# EAGLE design PCB-BI8-SE-C30 (EAGLE 6.4)
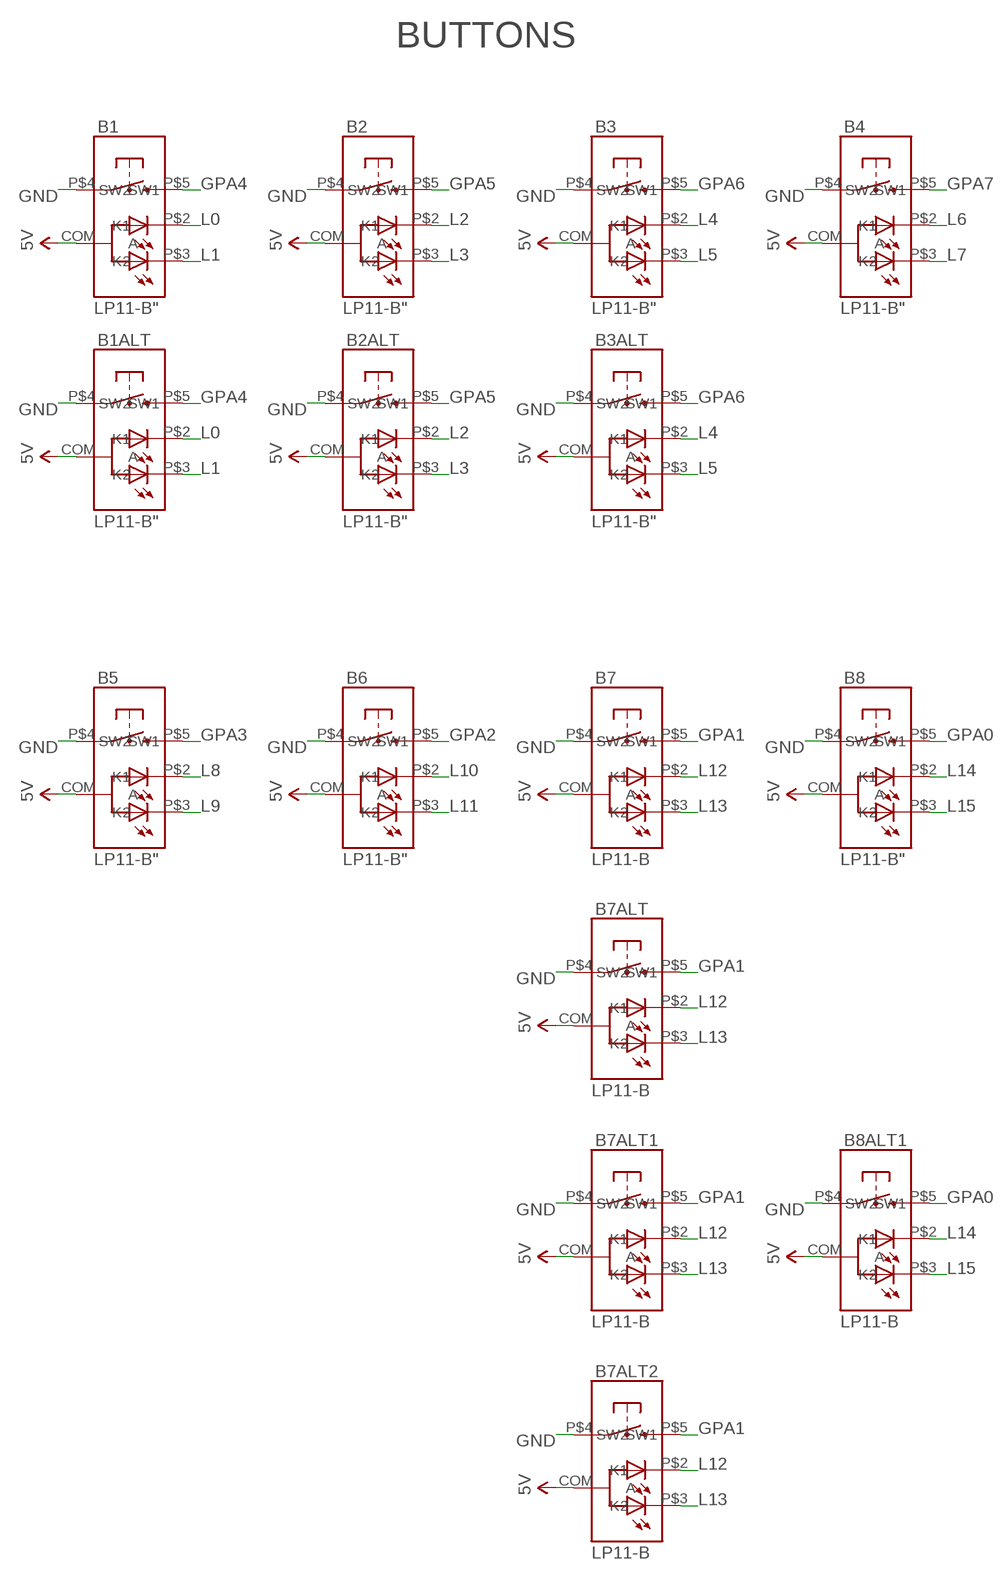
[diagram p0: schematic, sheet 1, part 1 of 2]
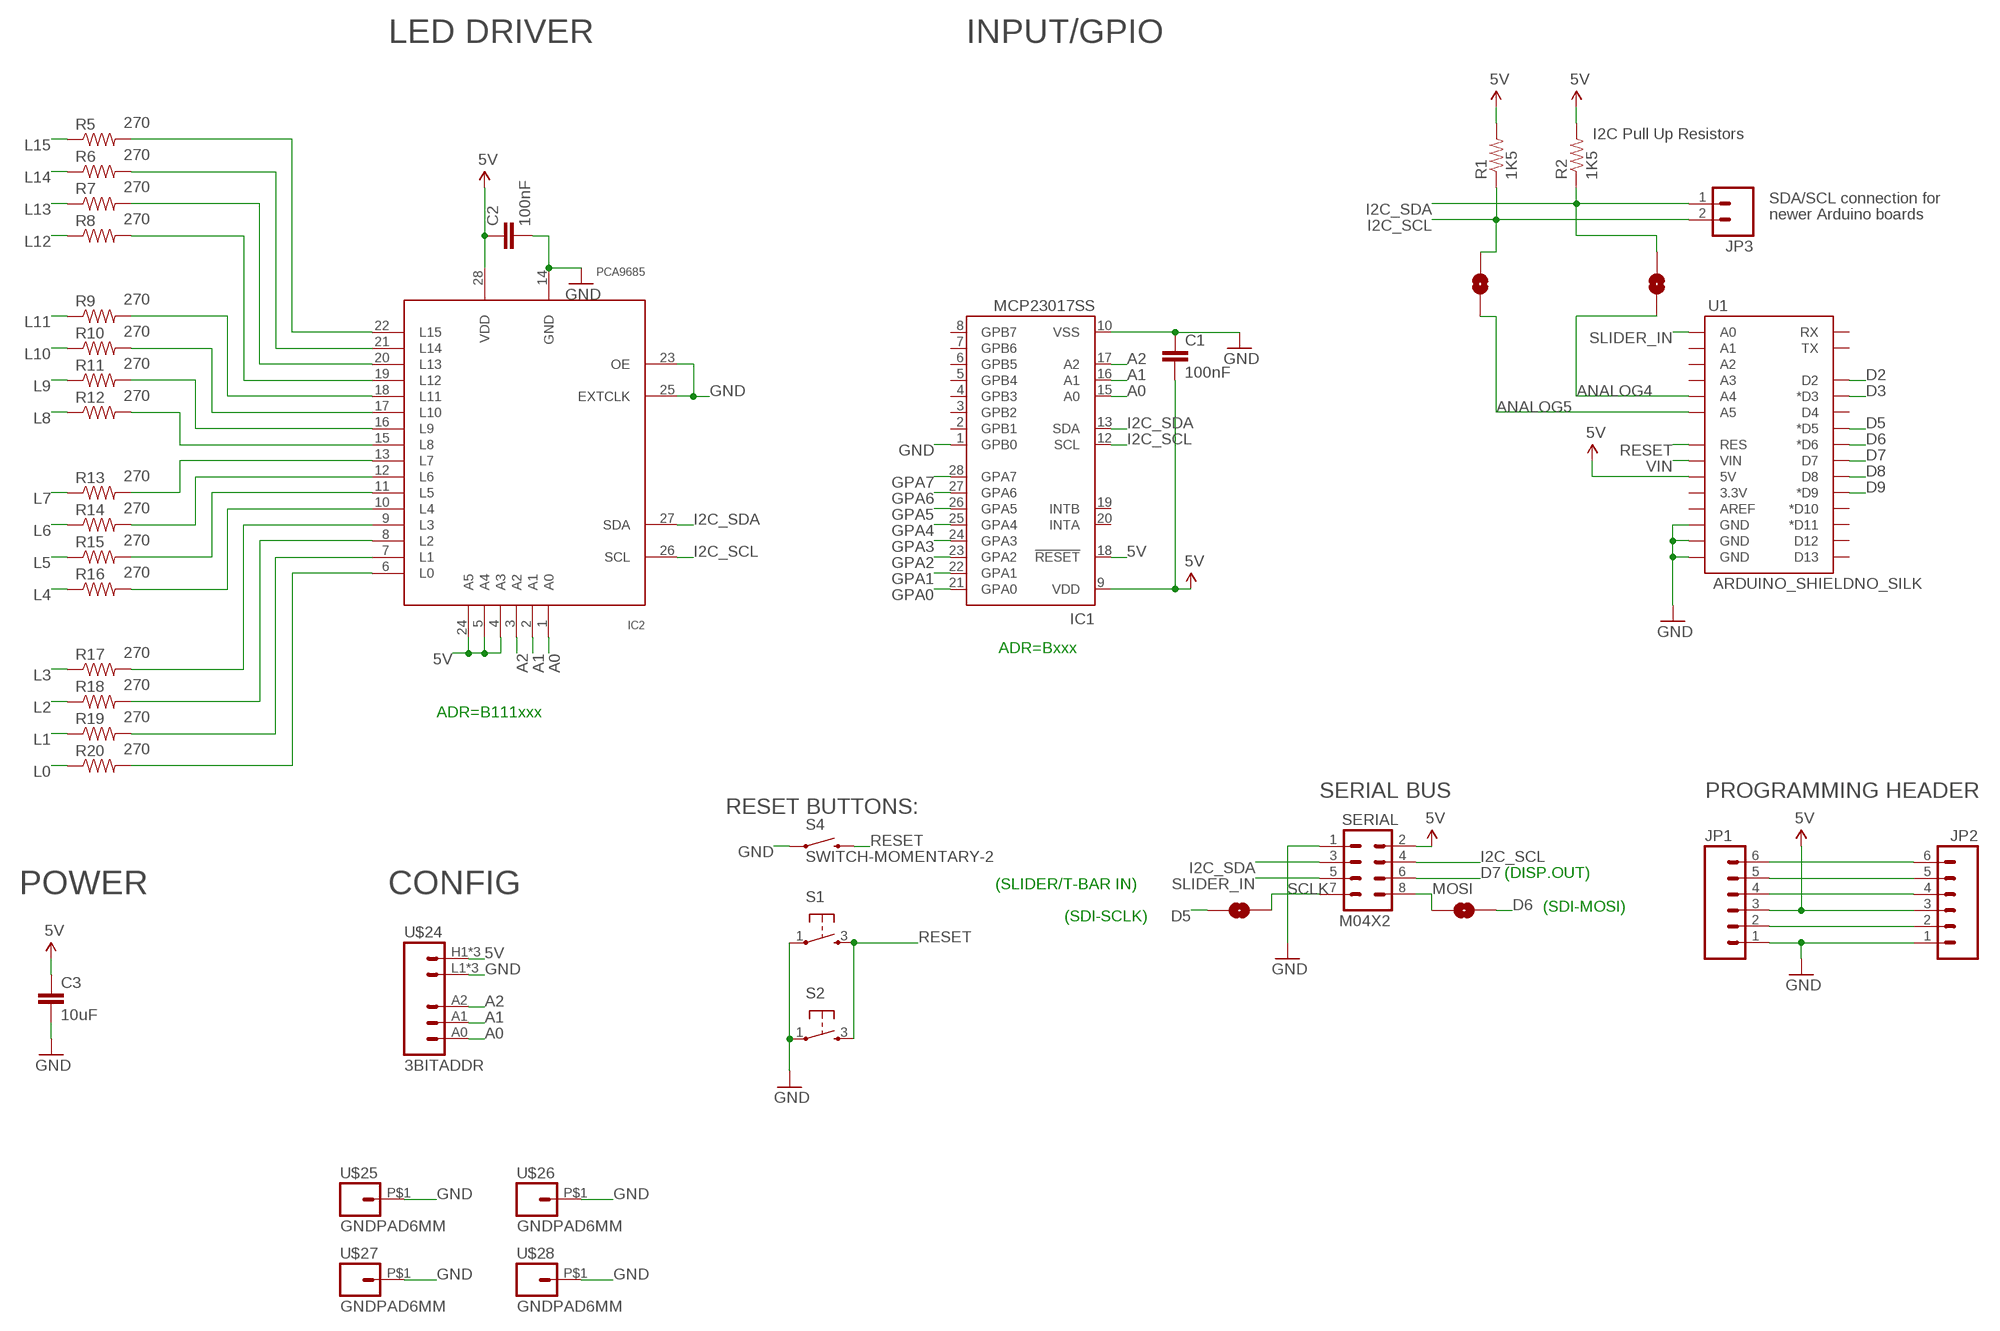
[diagram p1: schematic, sheet 1, part 2 of 2]

## Parts
B1  LP11-B"  [LP11]
B1ALT  LP11-B"  [LP11]
B2  LP11-B"  [LP11]
B2ALT  LP11-B"  [LP11]
B3  LP11-B"  [LP11]
B3ALT  LP11-B"  [LP11]
B4  LP11-B"  [LP11]
B5  LP11-B"  [LP11]
B6  LP11-B"  [LP11]
B7  LP11-B  [LP11_NOFIXHOLES]
B7ALT  LP11-B  [LP11_NOFIXHOLES]
B7ALT1  LP11-B  [LP11_NOFIXHOLES]
B7ALT2  LP11-B  [LP11_NOFIXHOLES]
B8  LP11-B"  [LP11]
B8ALT1  LP11-B  [LP11_NOFIXHOLES]
C1  100nF  CAP0603-CAP  [0603-CAP]
C2  100nF  CAP0603-CAP  [0603-CAP]
C3  10uF  CAP0805  [0805]
IC1  MCP23017SS  [SSOP28]
IC2  PCA9685  [TSSOP28]
JP1  M06POLAR  [MOLEX-1X6]
JP2  M06POLAR  [MOLEX-1X6]
JP3  M02PTH  [1X02]
MOSI->D6  SOLDERJUMPERNC  [SJ_2S]
R1  1K5  RESISTOR0603-RES  [0603-RES]
R2  1K5  RESISTOR0603-RES  [0603-RES]
R5  270  RESISTOR0603-RES  [0603-RES]
R6  270  RESISTOR0603-RES  [0603-RES]
R7  270  RESISTOR0603-RES  [0603-RES]
R8  270  RESISTOR0603-RES  [0603-RES]
R9  270  RESISTOR0603-RES  [0603-RES]
R10  270  RESISTOR0603-RES  [0603-RES]
R11  270  RESISTOR0603-RES  [0603-RES]
R12  270  RESISTOR0603-RES  [0603-RES]
R13  270  RESISTOR0603-RES  [0603-RES]
R14  270  RESISTOR0603-RES  [0603-RES]
R15  270  RESISTOR0603-RES  [0603-RES]
R16  270  RESISTOR0603-RES  [0603-RES]
R17  270  RESISTOR0603-RES  [0603-RES]
R18  270  RESISTOR0603-RES  [0603-RES]
R19  270  RESISTOR0603-RES  [0603-RES]
R20  270  RESISTOR0603-RES  [0603-RES]
S1  TAC_SWITCH  [PUSHBUTTON]
S2  TAC_SWITCH  [PUSHBUTTON]
S3->A2  SOLDERJUMPERNC  [SJ_2S]
S3->A3  SOLDERJUMPERNC  [SJ_2S]
S4  SWITCH-MOMENTARY-2  [TACTILE_SWITCH_TALL]
SCLK->D5  SOLDERJUMPERNC  [SJ_2S]
SERIAL  M04X2  [2X4]
U1  ARDUINO_SHIELDNO_SILK  [DUEMILANOVE_VIAS]
U$24  3BITADDR  [3BITADDR]
U$25  GNDPAD6MM  [3.2MMPAD6MM]
U$26  GNDPAD6MM  [3.2MMPAD6MM]
U$27  GNDPAD6MM  [3.2MMPAD6MM]
U$28  GNDPAD6MM  [3.2MMPAD6MM]

## Nets
5V [Power]: B1.COM(A) B1ALT.COM(A) B2.COM(A) B2ALT.COM(A) B3.COM(A) B3ALT.COM(A) B4.COM(A) B5.COM(A) B6.COM(A) B7.COM(A) B7ALT1.COM(A) B7ALT2.COM(A) B7ALT.COM(A) B8.COM(A) B8ALT1.COM(A) C1.2 C2.1 C3.1 IC1.9(VDD) IC1.18(!RESET) IC2.4(A3) IC2.5(A4) IC2.24(A5) IC2.28(VDD) JP1.3 JP2.3 R1.2 R2.2 SERIAL.2 U1.5V U$24.H1(VCC) U$24.H2(VCC) U$24.H3(VCC)
A0: IC1.15(A0) IC2.1(A0) U$24.A0
A1: IC1.16(A1) IC2.2(A1) U$24.A1
A2: IC1.17(A2) IC2.3(A2) U$24.A2
ANALOG4: S3->A3.2 U1.A4
ANALOG5: S3->A2.2 U1.A5
D2: U1.D2
D3: U1.D3(*D3)
D5: SCLK->D5.1 U1.D5(*D5)
D6: MOSI->D6.2 U1.D6(*D6)
D7: SERIAL.6 U1.D7
D8: U1.D8
D9: U1.D9(*D9)
GND [Power]: B1.P$4(SW1) B1ALT.P$4(SW1) B2.P$4(SW1) B2ALT.P$4(SW1) B3.P$4(SW1) B3ALT.P$4(SW1) B4.P$4(SW1) B5.P$4(SW1) B6.P$4(SW1) B7.P$4(SW1) B7ALT1.P$4(SW1) B7ALT2.P$4(SW1) B7ALT.P$4(SW1) B8.P$4(SW1) B8ALT1.P$4(SW1) C1.1 C2.2 C3.2 IC1.1(GPB0) IC1.10(VSS) IC2.14(GND) IC2.23(OE) IC2.25(EXTCLK) JP1.1 JP2.1 S1.1 S2.1 S4.A2 SERIAL.1 U1.GND@0(GND) U1.GND@1(GND) U1.GND@2(GND) U$24.L1(GND) U$24.L2(GND) U$24.L3(GND) U$25.P$1 U$26.P$1 U$27.P$1 U$28.P$1
GPA0: B8.P$5(SW2) B8ALT1.P$5(SW2) IC1.21(GPA0)
GPA1: B7.P$5(SW2) B7ALT1.P$5(SW2) B7ALT2.P$5(SW2) B7ALT.P$5(SW2) IC1.22(GPA1)
GPA2: B6.P$5(SW2) IC1.23(GPA2)
GPA3: B5.P$5(SW2) IC1.24(GPA3)
GPA4: B1.P$5(SW2) B1ALT.P$5(SW2) IC1.25(GPA4)
GPA5: B2.P$5(SW2) B2ALT.P$5(SW2) IC1.26(GPA5)
GPA6: B3.P$5(SW2) B3ALT.P$5(SW2) IC1.27(GPA6)
GPA7: B4.P$5(SW2) IC1.28(GPA7)
I2C_SCL: IC1.12(SCL) IC2.26(SCL) JP3.2 R1.1 S3->A2.1 SERIAL.4
I2C_SDA: IC1.13(SDA) IC2.27(SDA) JP3.1 R2.1 S3->A3.1 SERIAL.3
L0: B1.P$2(K1) B1ALT.P$2(K1) R20.1
L1: B1.P$3(K2) B1ALT.P$3(K2) R19.1
L2: B2.P$2(K1) B2ALT.P$2(K1) R18.1
L3: B2.P$3(K2) B2ALT.P$3(K2) R17.1
L4: B3.P$2(K1) B3ALT.P$2(K1) R16.1
L5: B3.P$3(K2) B3ALT.P$3(K2) R15.1
L6: B4.P$2(K1) R14.1
L7: B4.P$3(K2) R13.1
L8: B5.P$2(K1) R12.1
L9: B5.P$3(K2) R11.1
L10: B6.P$2(K1) R10.1
L11: B6.P$3(K2) R9.1
L12: B7.P$2(K1) B7ALT1.P$2(K1) B7ALT2.P$2(K1) B7ALT.P$2(K1) R8.1
L13: B7.P$3(K2) B7ALT1.P$3(K2) B7ALT2.P$3(K2) B7ALT.P$3(K2) R7.1
L14: B8.P$2(K1) B8ALT1.P$2(K1) R6.1
L15: B8.P$3(K2) B8ALT1.P$3(K2) R5.1
MOSI: MOSI->D6.1 SERIAL.8
N$1: JP1.2 JP2.2
N$4: IC2.13(L7) R13.2
N$5: IC2.12(L6) R14.2
N$7: IC2.11(L5) R15.2
N$9: IC2.10(L4) R16.2
N$10: IC2.9(L3) R17.2
N$11: IC2.8(L2) R18.2
N$12: IC2.7(L1) R19.2
N$19: IC2.6(L0) R20.2
N$20: IC2.15(L8) R12.2
N$21: IC2.16(L9) R11.2
N$22: IC2.17(L10) R10.2
N$23: IC2.18(L11) R9.2
N$24: IC2.19(L12) R8.2
N$25: IC2.20(L13) R7.2
N$26: IC2.21(L14) R6.2
N$27: IC2.22(L15) R5.2
N$33: JP1.4 JP2.4
N$34: JP1.5 JP2.5
N$45: JP1.6 JP2.6
RESET: S1.3 S2.3 S4.B2 U1.RES
SCLK: SCLK->D5.2 SERIAL.7
SLIDER_IN: SERIAL.5 U1.A0
VIN [Power]: U1.VIN
Unconnected: IC1.2(GPB1) IC1.3(GPB2) IC1.4(GPB3) IC1.5(GPB4) IC1.6(GPB5) IC1.7(GPB6) IC1.8(GPB7) IC1.19(INTB) IC1.20(INTA) U1.3.3V U1.A1 U1.A2 U1.A3 U1.AREF U1.D4 U1.D10(*D10) U1.D11(*D11) U1.D12 U1.D13 U1.RX U1.TX

## Notes on the sheet
- BUTTONS | LED DRIVER | INPUT/GPIO
- I2C Pull Up Resistors
- SDA/SCL connection for
- newer Arduino boards
- ADR=Bxxx
- ADR=B111xxx
- SERIAL BUS | PROGRAMMING HEADER
- RESET BUTTONS:
- (DISP.OUT)
- (SLIDER/T-BAR IN)
- POWER | CONFIG
- (SDI-MOSI)
- (SDI-SCLK)

## Library data of the parts
B1 B1ALT B2 B2ALT B3 B3ALT B4-B7 B7ALT B7ALT1 B7ALT2 B8 B8ALT1 = SKAARHOJ:LP11-B
C1-C3 = SparkFun:CAP: Capacitor Standard 0603 ceramic capacitor, and 0.1" leaded capacitor.
IC1 = microchip:MCP23017: http://ww1.microchip.com/downloads/en/DeviceDoc/21952a.pdf Source: http://ww1.microchip.com/downloads/en/DeviceDoc/21952a.pdf; MF: MICROCHIP; MPN: MCP23017-E/SS; OC_FARNELL: 1467674; OC_NEWARK: 31K2960
IC2 = wsmith:PCA9685
JP1 JP2 = SparkFun:M06: Header 6 Standard 6-pin 0.1" header. Use with straight break away headers (SKU : PRT-00116), right angle break away headers (PRT-00553), swiss pins (PRT-00743), machine pins (PRT-00117), and female headers (PRT-00115). Molex polarized connector foot print use with SKU : PRT-08094 with associated crimp pins and housings. NOTES ON THE VARIANTS LOCK and LOCK_LONGPADS... This footprint was designed to help hold the alignment of a through-hole component (i.e. 6-pin header) while soldering it into place. You may notice that each hole has been shifted either up or down by 0.005 of an inch from it's more standard position (which is a perfectly straight line). This slight alteration caused the pins (the squares in the middle) to touch the edges of the holes. Because they are alternating, it causes a "brace" to hold the component in place. 0.005 has proven to be the perfect amount of "off-center" position when using our standard breakaway headers. Although looks a little odd when you look at the bare footprint, once you have a header in there, the alteration is very hard to notice. Also, if you push a header all the way into place, it is covered up entirely on the bottom side. This idea of altering the position of holes to aid alignment will be further integrated into the Sparkfun Library for other footprints. It can help hold any component with 3 or more connection pins.
JP3 = SparkFun:M02: Header 2 Standard 2-pin 0.1" header. Use with straight break away headers (SKU : PRT-00116), right angle break away headers (PRT-00553), swiss pins (PRT-00743), machine pins (PRT-00117), and female headers (PRT-00115). Molex polarized connector foot print use with SKU : PRT-08233 with associated crimp pins and housings.
MOSI->D6 S3->A2 S3->A3 SCLK->D5 = SparkFun:SOLDERJUMPER: Solder Jumper Standard SMD solder jumper. Used to automate production. Two varients : Normally Open and Normally Closed are the same, but have different paste layers. NC will have a large amount of paste and should jumper during reflow.
R1 R2 R5-R20 = SparkFun:RESISTOR: Resistor Basic schematic elements and footprints for 0603, 1206, and PTH resistors.
S1 S2 = SKAARHOJ:TAC_SWITCH: Momentary Switch Button commonly used for reset or general input. Spark Fun Electronics SKU : COM-00097
S4 = SparkFun:SWITCH-MOMENTARY-2
SERIAL = SparkFun:M04X2
U1 = SparkFun:ARDUINO_SHIELD
U$24 = SKAARHOJ:3BITADDR
U$25-U$28 = SKAARHOJ:GNDPAD

## Net classes
0 default: width 0.203 mm, drill 0.406 mm, clearance 0.203 mm
1 Power: width 0.406 mm, drill 0.61 mm, clearance 0.203 mm

## Board
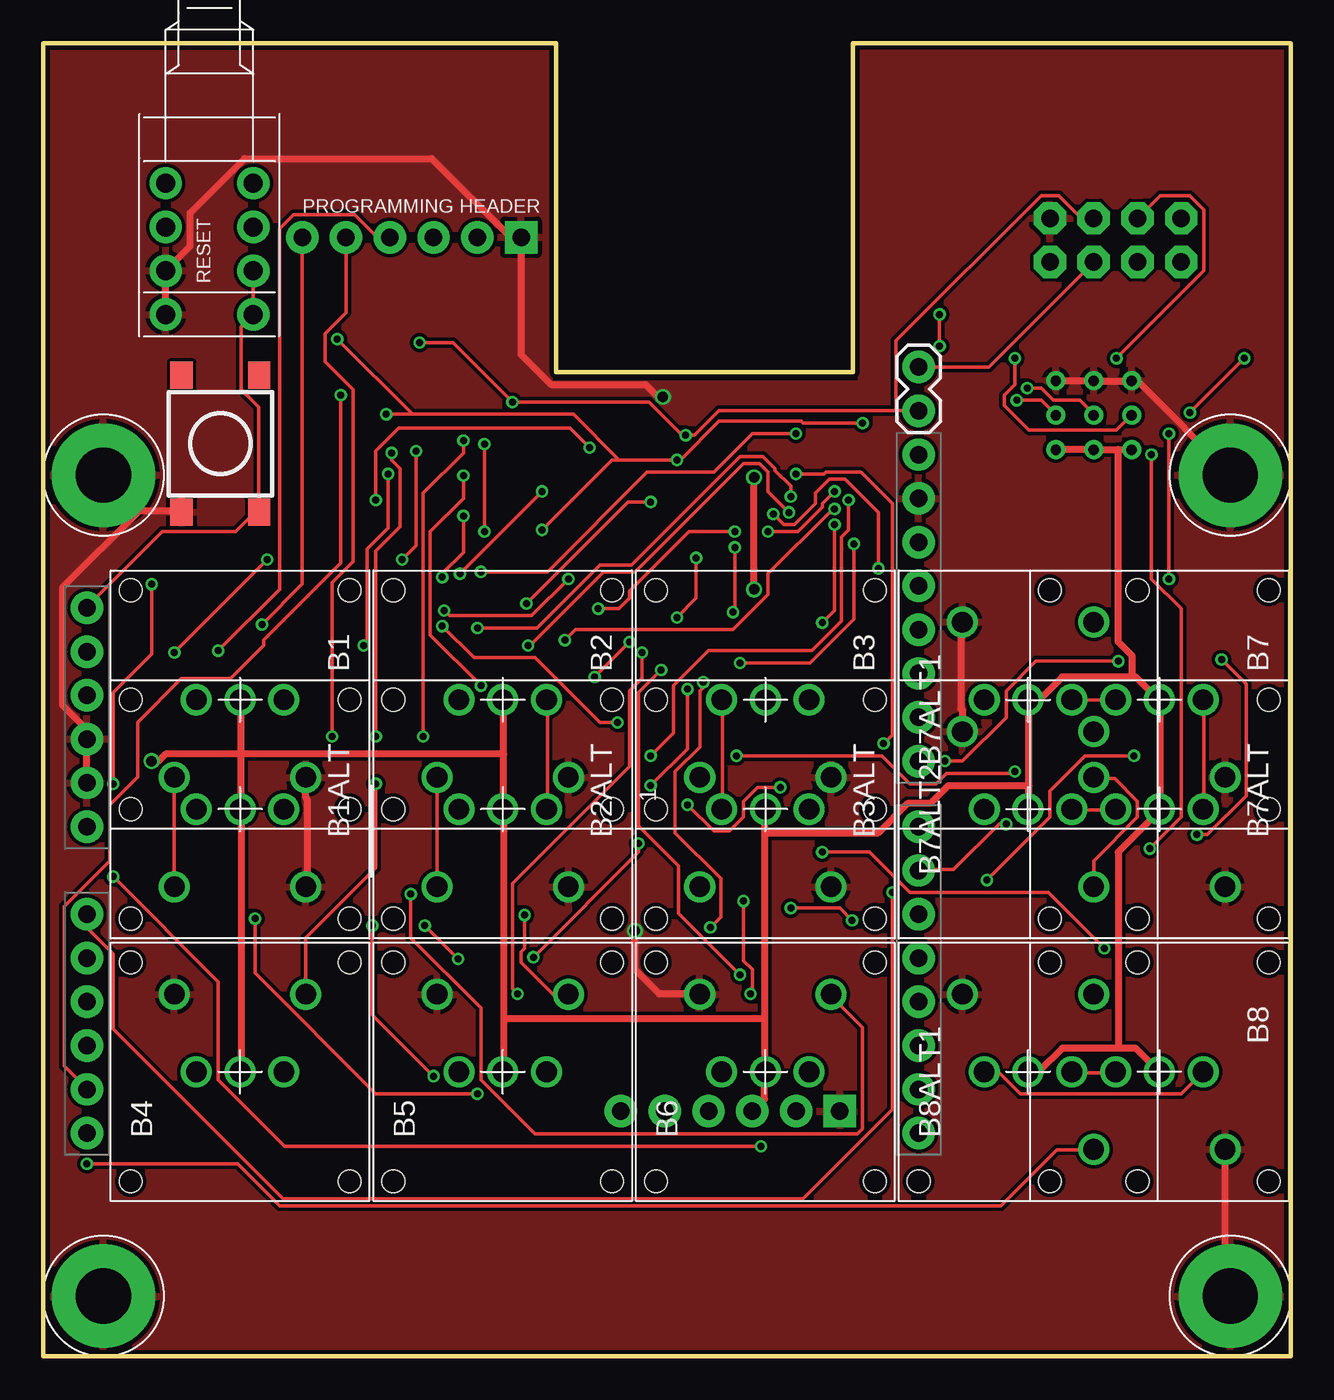
[diagram p2: board, top side]
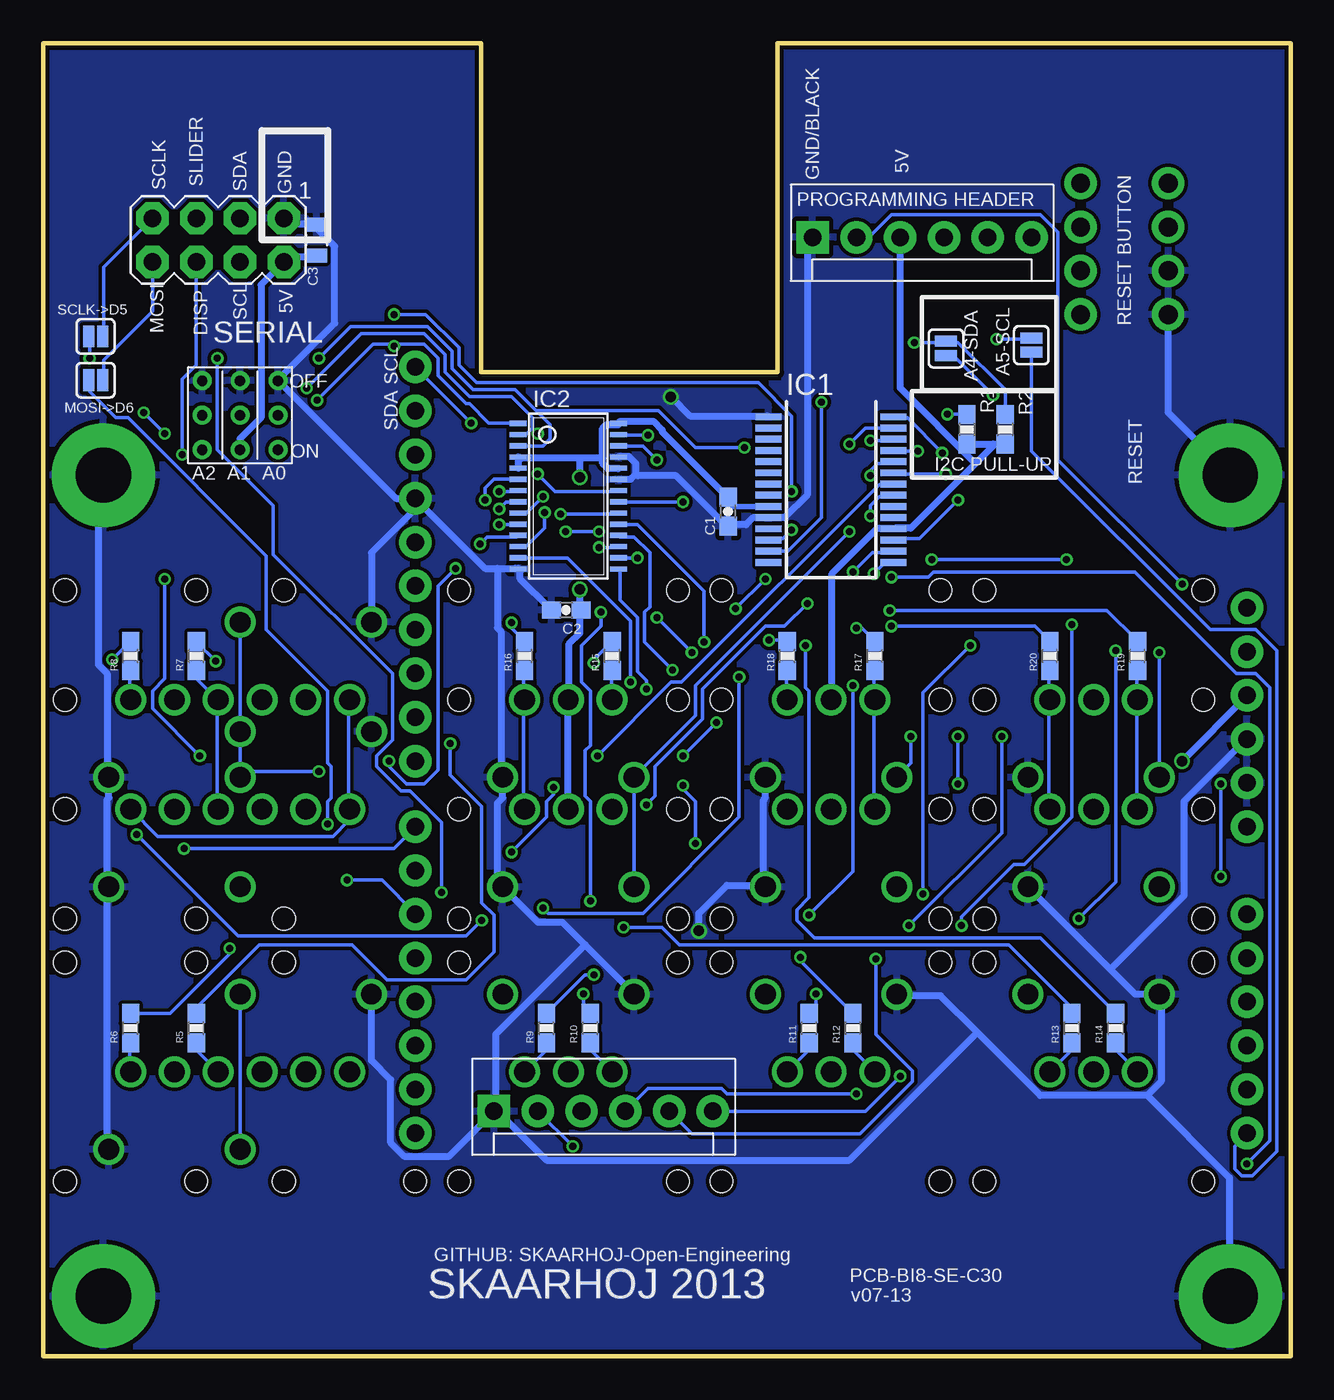
[diagram p3: board, bottom side, seen from below]

Size 72.39 x 76.2 mm. Coordinates in mm from the lower left corner, seen from the top.
Outline: 46.99,76.2 46.99,57.1 29.77,57.1 29.77,76.2 0,76.2 0,0 72.39,0 72.39,76.2 46.99,76.2
Copper layers (1*16): Top 0.035mm / dielectric 1.5mm / Bottom 0.035mm
Design rules "Fusion_eagle_rule_v1.1": minimum track width 6mil, minimum drill 12mil, track to track 6mil, track to pad 6mil, pad to pad 6mil, via to via 6mil, smd to smd 0mil, copper to edge 10mil, drill to drill 10mil, minimum pad ring 10mil, minimum via ring 6mil, stop-mask expansion 2mil, vias tented up to drill 100mil, thermal gap 10mil
Holes 1.3 mm at 63.5,22.86 63.5,10.16 50.8,10.16 71.12,44.45 58.42,44.45 63.5,44.45 63.5,25.4 58.42,25.4 71.12,25.4 71.12,31.75 71.12,38.1
tRestrict: area 29.6,56.6 to 47.2,76.2
bRestrict: area 29.6,56.6 to 47.2,76.2

### Footprints (pad centres in the part's own frame; a part is rotated, then mirrored left to right if it is on the bottom)
LP11 = drill 1.2: COM 0,0; P$2 0,2.54; P$3 0,-2.54; P$4 4.5,3.81; P$5 4.5,-3.81 | hole 1.3: -6.35,6.35; 6.35,6.35; 6.35,-6.35; -6.35,-6.35
LP11_NOFIXHOLES = drill 1.2: COM 0,0; P$2 0,2.54; P$3 0,-2.54; P$4 4.5,3.81; P$5 4.5,-3.81
0603-CAP = smd 1.1 x 1: 1 -0.85,0; 2 0.85,0
0805 = smd 0.8 x 1.2: 1 -0.9,0; 2 0.9,0
SSOP28 = smd 0.4 x 1.5: 1 -4.225,-3.625; 2 -3.575,-3.625; 3 -2.925,-3.625; 4 -2.275,-3.625; 5 -1.625,-3.625; 6 -0.975,-3.625; 7 -0.325,-3.625; 8 0.325,-3.625; 9 0.975,-3.625; 10 1.625,-3.625; 11 2.275,-3.625; 12 2.925,-3.625; 13 3.575,-3.625; 14 4.225,-3.625; 15 4.225,3.625; 16 3.575,3.625; 17 2.925,3.625; 18 2.275,3.625; 19 1.625,3.625; 20 0.975,3.625; 21 0.325,3.625; 22 -0.325,3.625; 23 -0.975,3.625; 24 -1.625,3.625; 25 -2.275,3.625; 26 -2.925,3.625; 27 -3.575,3.625; 28 -4.225,3.625
TSSOP28 = smd 0.305 x 0.991: 1 -4.225,-2.918; 2 -3.575,-2.918; 3 -2.925,-2.918; 4 -2.275,-2.918; 5 -1.625,-2.918; 6 -0.975,-2.918; 7 -0.325,-2.918; 8 0.325,-2.918; 9 0.975,-2.918; 10 1.625,-2.918; 11 2.275,-2.918; 12 2.925,-2.918; 13 3.575,-2.918; 14 4.225,-2.918; 15 4.225,2.918; 16 3.575,2.918; 17 2.925,2.918; 18 2.275,2.918; 19 1.625,2.918; 20 0.975,2.918; 21 0.325,2.918; 22 -0.325,2.918; 23 -0.975,2.918; 24 -1.625,2.918; 25 -2.275,2.918; 26 -2.925,2.918; 27 -3.575,2.918; 28 -4.225,2.918
MOLEX-1X6 = drill 1.016 pad 1.88 square: 1 0,0 | drill 1.016 pad 1.88: 2 2.54,0; 3 5.08,0; 4 7.62,0; 5 10.16,0; 6 12.7,0
1X02 = drill 1.016 pad 1.88: 1 0,0; 2 2.54,0
SJ_2S = smd 0.635 x 1.27: 1 -0.412,0; 2 0.412,0
0603-RES = smd 1.1 x 1: 1 -0.85,0; 2 0.85,0
PUSHBUTTON = drill 1.1 pad 1.88: 1 2.54,2.54; 2 2.54,-2.54; 3 -2.54,2.54; 4 -2.54,-2.54
TACTILE_SWITCH_TALL = smd 1.55 x 1.3: A1 -3.975,-2.25; A2 3.975,-2.25; B1 -3.975,2.25; B2 3.975,2.25
2X4 = drill 1.016 pad 1.88 octagon: 1 -3.81,-1.27; 2 -3.81,1.27; 3 -1.27,-1.27; 4 -1.27,1.27; 5 1.27,-1.27; 6 1.27,1.27; 7 3.81,-1.27; 8 3.81,1.27
DUEMILANOVE_VIAS = drill 1.016 pad 1.88: 3.3V 50.8,13.97; 5V 50.8,16.51; A0 50.8,29.21; A1 50.8,31.75; A2 50.8,34.29; A3 50.8,36.83; A4 50.8,39.37; A5 50.8,41.91; AREF 2.54,2.54; D2 2.54,36.83; D3 2.54,34.29; D4 2.54,31.75; D5 2.54,29.21; D6 2.54,26.67; D7 2.54,24.13; D8 2.54,20.32; D9 2.54,17.78; D10 2.54,15.24; D11 2.54,12.7; D12 2.54,10.16; D13 2.54,7.62; GND@0 50.8,19.05; GND@1 50.8,21.59; GND@2 2.54,5.08; RES 50.8,11.43; RX 2.54,41.91; TX 2.54,39.37; VIN 50.8,24.13
3BITADDR = drill 0.6: A0 -2.2,0; A1 0,0; A2 2.2,0; H1 -2.2,2; H2 0,2; H3 2.2,2; L1 -2.2,-2; L2 0,-2; L3 2.2,-2
3.2MMPAD6MM = drill 3.2 pad 6: P$1 0,0

### Placement (x,y rotation side)
B1  11.43,38.1 270 top
B1ALT  11.43,31.75 270 top
B2  26.67,38.1 270 top
B2ALT  26.67,31.75 270 top
B3  41.91,38.1 270 top
B3ALT  41.91,31.75 270 top
B4  11.43,16.51 90 top
B5  26.67,16.51 90 top
B6  41.91,16.51 90 top
B7  64.77,38.1 270 top
B7ALT  64.77,31.75 270 top
B7ALT1  57.15,38.1 90 top
B7ALT2  57.15,31.75 90 top
B8  64.77,16.51 270 top
B8ALT1  57.15,16.51 90 top
C1  32.64,49.02 90 bottom
C2  42.04,43.31 180 bottom
C3  56.52,64.77 90 bottom
IC1  26.67,50.29 270 bottom
IC2  41.91,49.91 270 bottom
JP1  46.23,14.22 0 bottom
JP2  27.74,64.93 0 bottom
JP3  50.8,54.86 90 top
MOSI->D6  69.34,56.64 180 bottom
R1  18.8,53.78 270 bottom
R2  16.57,53.78 270 bottom
R5  63.5,19.05 90 bottom
R6  67.31,19.05 90 bottom
R7  63.5,40.64 90 bottom
R8  67.31,40.64 90 bottom
R9  43.18,19.05 90 bottom
R10  40.64,19.05 90 bottom
R11  27.94,19.05 90 bottom
R12  25.4,19.05 90 bottom
R13  12.7,19.05 90 bottom
R14  10.16,19.05 90 bottom
R15  39.37,40.64 90 bottom
R16  44.45,40.64 90 bottom
R17  24.13,40.64 90 bottom
R18  29.21,40.64 90 bottom
R19  8.89,40.64 90 bottom
R20  13.97,40.64 90 bottom
S1  9.65,62.99 180 top
S2  9.65,65.53 180 top
S3->A2  15.05,58.67 270 bottom
S3->A3  20,58.48 270 bottom
S4  10.29,52.96 270 top
SCLK->D5  69.34,59.18 0 bottom
SERIAL  62.23,64.77 180 bottom
U1  53.34,54.86 180 top
U$24  60.96,54.61 180 bottom
U$25  68.89,3.5 270 top
U$26  3.5,3.5 270 top
U$27  68.89,51.13 270 top
U$28  3.5,51.13 270 top

### Tracks (layer width: path | path; a pad name or v marks a point on that pad's centre or on a via)
5V  (via drill 0.61)
  Top 0.406: U$24.H1 58.83,52.63 60.96,52.63 U$24.H2 61.06,52.63 62.38,52.63 | 62.38,52.63 63.09,52.63 U$24.H3 | 62.38,17.88 63.4,17.88 B8.COM | 62.38,17.88 59.13,17.88 57.81,16.56 57.2,16.56 B8ALT1.COM | 57.2,33.12 57.2,31.8 B7ALT2.COM | 57.2,33.12 57.2,38.1 B7ALT1.COM 57.3,38.2 57.91,38.2 59.13,39.42 63.2,39.42 | 63.2,39.42 63.4,39.42 64.62,38.2 B7.COM 64.82,38.1 64.82,31.8 B7ALT.COM 64.72,31.6 62.38,29.26 62.38,17.88 | 62.38,52.63 62.38,41.45 63.2,40.64 63.2,39.42 | JP1.3 41.86,14.94 41.86,16.46 B6.COM 41.86,16.66 41.86,19.61 | 41.86,30.38 41.86,31.7 B3ALT.COM | 41.86,30.38 41.86,19.61 | v41.25,44.5 v41.25,51 | 11.48,34.95 11.48,31.8 B1ALT.COM 11.48,31.6 11.48,16.56 B4.COM | 11.48,34.95 11.48,38.1 B1.COM | v6.3,34.54 6.71,34.54 7.11,34.95 11.48,34.95 | 26.72,34.95 26.72,31.8 B2ALT.COM 26.72,31.6 26.72,19.61 | 26.72,34.95 26.72,38.1 B2.COM | 26.72,19.61 26.72,16.56 B5.COM | 26.72,34.95 11.48,34.95 | 26.72,19.61 41.86,19.61 | 57.2,33.12 52.53,33.12 51.51,32.11 50.19,32.11 48.46,30.38 41.86,30.38
  Bottom 0.305: C1.2 32.64,49.32 IC1.9
  Bottom 0.406: C3.1 56.59,63.8 58.12,63.8 SERIAL.2 59.74,62.18 59.74,54.46 60.96,53.24 U$24.H2 | IC2.5 44.81,51.61 44.81,52.12 IC2.4 44.6,52.12 41.25,52.12 | 39.93,52.12 39.93,51.82 39.62,51.51 39.01,51.51 IC2.24 | 39.93,52.12 39.93,53.85 39.73,54.05 39.01,54.05 IC2.28 38.91,54.25 36.98,54.25 36.47,53.75 36.47,53.65 32.72,49.89 C1.2 | 39.93,52.12 41.25,52.12 | B3ALT.COM 41.96,31.8 41.96,38 B3.COM 41.86,38.1 41.86,41.35 41.25,41.96 41.25,43.28 C2.1 41.25,43.48 v41.25,44.5 | v41.25,51 41.25,52.12 | v6.3,34.54 2.54,38.3 U1.5V | R1.2 17.27,52.93 | 17.27,52.93 16.66,52.93 R2.2 | R1.2 | 18.29,51.82 17.27,52.83 17.27,52.93 | 18.29,51.82 22.05,48.06 22.96,48.06 IC1.18 23.16,48.06 23.98,48.06 26.62,45.41 26.62,38.1 B2.COM | JP2.3 22.66,56.19 18.29,51.82
A0  (via drill 0.41)
  Top 0.203: v56.49,55.47 57.91,55.47 58.73,54.66 U$24.A0 | v28.96,50.19 v24.18,45.41 | v52.02,58.62 v52.02,60.45
  Bottom 0.203: 52.02,58.73 53.24,58.73 v56.49,55.47 | 52.02,58.73 50.29,58.73 49.48,57.91 49.48,56.9 47.85,55.27 47.65,55.27 46.53,54.15 44.91,54.15 IC2.1 | v24.18,45.41 23.57,46.02 23.06,46.02 IC1.15 | v28.96,50.19 28.96,54.56 30.89,56.49 47.24,56.49 48.26,57.51 48.26,58.52 50.19,60.45 v52.02,60.45 | 52.02,58.73 v52.02,58.62
A1  (via drill 0.41)
  Top 0.203: v57.1,56.19 57.91,56.19 58.62,55.47 60.15,55.47 60.96,54.66 U$24.A1 | v25.4,45.52 29.26,45.52 35.05,51.31 38.91,51.31 41.15,53.54 v43.69,53.54
  Bottom 0.203: 43.99,53.85 44.3,53.54 44.81,53.54 IC2.2 | 43.99,53.85 43.99,54.46 45.21,55.68 47.65,55.68 49.07,57.1 49.07,58.12 50.29,59.33 53.95,59.33 v57.1,56.19 | v25.4,45.52 24.28,46.63 23.06,46.63 IC1.16 | 43.99,53.85 v43.69,53.54
A2  (via drill 0.41)
  Top 0.203: v56.39,57.91 56.39,56.39 55.78,55.78 55.78,55.17 57.2,53.75 62.28,53.75 63.09,54.56 U$24.A2 | v19.3,49.68 19.3,52.53 20.62,53.85 30.58,53.85 v31.7,52.73
  Bottom 0.203: 43.74,54.81 45.01,56.08 47.45,56.08 48.67,57.3 48.67,58.32 50.09,59.74 54.56,59.74 v56.39,57.91 | 43.74,54.81 42.98,54.05 42.98,53.24 43.38,52.83 44.81,52.83 IC2.3 | v19.3,49.68 21.54,47.45 22.96,47.45 IC1.17 | v31.7,52.73 34.54,52.73 36.68,54.86 43.69,54.86 43.74,54.81
ANALOG4  (via drill 0.41)
  Top 0.203: v17.27,55.78 17.27,46.02 12.8,41.55 12.8,41.25 10.87,39.32 8.03,39.32 5.49,36.78 5.49,33.63 3.86,32 3.86,28.75 1.22,26.11 1.22,16.87 2.54,15.54 U1.A4
  Bottom 0.203: v17.27,55.78 19.51,58.01 19.91,58.01 S3->A3.2
ANALOG5
  Bottom 0.203: S3->A2.2 15.04,58.22 15.04,52.53 4.67,42.16 2.03,42.16 0.81,40.95 0.81,11.89 2.23,10.46 2.85,10.46 3.25,10.87 3.25,12.19 2.54,12.9 U1.A5
D5  (via drill 0.41)
  Top 0.203: v66.55,54.76 v69.7,57.91 | v65.33,45.11 v65.33,53.54 | v63.3,34.85 60.45,34.85 58.42,32.82 58.42,31.29 v54.76,27.64
  Bottom 0.203: v69.7,57.91 69.7,59.13 SCLK->D5.1 | v65.33,53.54 v66.55,54.76 | v65.33,45.11 65.33,39.32 66.04,38.61 66.04,37.59 v63.3,34.85 | v54.76,27.64 52.73,27.64 50.8,25.7 U1.D5
D6  (via drill 0.41)
  Top 0.203: v55.88,30.89 55.47,30.89 52.83,28.25 50.8,28.25 U1.D6
  Bottom 0.203: v55.88,30.89 55.88,32.21 55.68,32.41 55.68,34.24 55.88,34.44 55.88,38.61 59.44,42.16 59.44,46.43 67.46,54.46 68.17,54.46 69.7,55.98 69.7,56.59 MOSI->D6.2
D7  (via drill 0.41)
  Top 0.203: v64.31,52.32 64.31,45.11 66.04,43.38 66.04,31.29 v64.21,29.46
  Bottom 0.203: SERIAL.6 63.5,57.51 64.31,56.69 v64.31,52.32 | v64.21,29.46 52.02,29.46 50.8,30.68 U1.D7
GND  (via drill 0.61)
  Top 0.406: B1.P$4 15.24,32.41 15.34,32.31 15.34,27.43 15.24,27.33 B1ALT.P$4 | v35.97,55.68 35.66,55.68 34.95,56.39 29.46,56.39 27.74,58.12 JP2.1 27.64,65.02 27.03,65.02 22.55,69.49 11.68,69.49 8.53,66.34 8.53,64.41 S2.1 S1.1 | U1.GND@1 U1.GND@0 2.44,35.97 2.44,36.47 1.12,37.8 1.12,44.6 5.49,48.97 U$28.P$1 3.56,51.1 5.59,49.07 8.03,49.07 S4.A2 | B8.P$4 68.58,3.86 68.89,3.56 U$25.P$1 | v34.34,24.69 34.34,22.45 35.76,21.03 38.1,21.03 B6.P$4 | B7ALT2.P$4 53.34,37.49 53.24,37.59 53.24,42.47 53.34,42.57 B7ALT1.P$4 | U$24.L1 58.83,56.59 60.96,56.59 U$24.L2 61.06,56.59 63.09,56.59 U$24.L3 63.3,56.49 63.6,56.49 68.89,51.21 U$27.P$1
  Bottom 0.406: 10.46,22.45 15.24,27.23 B1ALT.P$4 | 10.46,22.45 9.04,21.03 7.62,21.03 B4.P$4 7.52,20.83 7.52,15.95 8.33,15.14 | 18.19,18.8 14.53,15.14 8.33,15.14 | 18.19,18.8 20.32,20.93 22.86,20.93 B5.P$4 | 8.33,15.14 3.56,10.36 3.56,3.56 U$26.P$1 | 38,51.21 38,51.82 38.41,52.22 38.91,52.22 IC2.25 | 38,51.21 38.3,50.9 38.91,50.9 IC2.23 | 38,51.21 37.9,51.1 35.66,51.1 32.82,48.26 C1.1 32.61,48.26 31.6,48.26 31.19,48.67 30.38,48.67 IC1.10 30.18,48.67 29.36,48.67 28.04,49.99 28.04,64.62 JP2.1 | v35.97,55.68 34.85,54.56 30.38,54.56 IC1.1 | S1.1 7.11,54.76 3.56,51.21 U$28.P$1 | 10.46,22.45 6.2,26.72 6.2,32.21 2.54,35.87 U1.GND@0 | B8.P$4 68.58,12.09 68.68,12.19 68.68,27.13 B7ALT.P$4 68.58,27.33 68.68,27.43 68.68,32.31 68.58,32.41 B7.P$4 68.68,33.73 68.68,39.62 69.19,40.13 69.19,50.9 68.99,51.1 U$27.P$1 | B8ALT1.P$4 53.34,17.17 52.22,16.05 52.22,12.39 51.41,11.58 48.87,11.58 JP1.1 | B2.P$4 30.48,32.41 30.58,32.31 30.58,27.43 30.48,27.33 B2ALT.P$4 30.68,27.33 32.72,27.33 34.34,25.7 v34.34,24.69 | 40.95,23.88 42.27,25.2 43.69,25.2 45.62,27.13 B3ALT.P$4 45.72,27.33 46.02,27.64 46.02,32.11 45.72,32.41 B3.P$4 45.82,33.73 45.82,42.06 46.02,42.27 46.02,45.72 | 40.95,23.88 38.1,21.03 B6.P$4 | 40.95,23.88 46.13,18.69 46.13,14.33 JP1.1 | 44.81,45.72 IC2.14 | IC2.14 44.7,45.52 44.7,45.11 42.98,43.38 C2.2 | 46.02,45.72 46.74,45.72 U1.GND@2 | 46.02,45.72 45.01,45.72 IC2.14 | B7ALT1.P$4 53.34,46.63 50.6,49.38 U1.GND@2 | SERIAL.1 58.12,65.73 56.59,65.73 C3.2 56.39,65.53 56.39,65.33 55.47,64.41 55.47,59.94 58.73,56.69 U$24.L1 58.62,56.49 51.92,49.78 U1.GND@2 | 18.19,18.8 25.6,11.38 43.18,11.38 46.02,14.22 JP1.1
  pour Top: 0,0 72.39,0 72.39,76.2 0,76.2
  pour Bottom: 0,0 72.39,0 72.39,76.2 0,76.2
GPA0  (via drill 0.41)
  Top 0.203: v24.38,48.77 24.38,46.63 23.16,45.41 v23.16,45.21 | v2.54,11.18 11.28,11.18 13.72,8.74 55.58,8.74 58.83,11.99 60.96,11.99 B8.P$5
  Bottom 0.203: v24.38,48.77 24.38,49.38 23.88,49.89 23.06,49.89 IC1.21 | v23.16,45.21 21.03,45.21 20.73,45.52 9.04,45.52 3.15,39.62 2.03,39.62 1.22,38.81 1.22,12.5 v2.54,11.18 | B8.P$5 B8ALT1.P$5
GPA1  (via drill 0.41)
  Top 0.203: v40.23,34.85 48.67,34.85 50.29,33.22 51.82,33.22 52.43,33.83 56.29,33.83 v56.39,33.93 | B7ALT.P$5 60.96,28.75 63.5,31.29 63.5,32.21 62.18,33.53 60.96,33.53 B7.P$5
  Bottom 0.203: B7ALT1.P$5 B7ALT2.P$5 B7.P$5 60.96,33.63 60.66,33.93 v56.39,33.93 | v40.23,34.85 35.97,39.12 35.36,39.12 23.88,50.6 23.06,50.6 IC1.22
GPA2  (via drill 0.41)
  Top 0.203: v20.02,51.21 20.02,48.06 18.8,46.84 18.8,41.45 v18.59,41.25 | v21.34,26.82 21.34,24.28 25.4,20.22 25.4,16.05 28.55,12.9 47.24,12.9 47.55,13.21 47.55,19.1 45.72,20.93 B6.P$5
  Bottom 0.203: v20.02,51.21 22.96,51.21 IC1.23 | v18.59,41.25 21.34,38.51 v21.34,26.82
GPA3  (via drill 0.41)
  Top 0.203: v24.38,51.1 24.38,49.78 22.45,47.85 22.45,41.86 v25.4,38.91 | v27.94,25.6 27.94,23.67 27.74,23.47 27.74,22.86 29.57,21.03 30.48,21.03 B5.P$5
  Bottom 0.203: v24.38,51.1 24.38,51.41 23.98,51.82 23.06,51.82 IC1.24 | v25.4,38.91 25.4,28.14 v27.94,25.6
GPA4  (via drill 0.41)
  Top 0.203: v21.64,52.53 21.64,47.04 v20.83,46.23 | v7.62,40.84 v13.01,46.23 | B1.P$5 B1ALT.P$5
  Bottom 0.203: v21.64,52.53 22.96,52.53 IC1.25 | v13.01,46.23 v20.83,46.23 | B1.P$5 v7.62,40.84
GPA5  (via drill 0.41)
  Top 0.203: v24.38,53.14 24.38,52.43 22.05,50.09 v22.05,35.97 | B2.P$5 B2ALT.P$5
  Bottom 0.203: v24.38,53.14 23.06,53.14 IC1.26 | v22.05,35.97 22.05,34.44 22.86,33.63 B2.P$5
GPA6  (via drill 0.41)
  Top 0.203: v25.6,47.85 v25.6,52.93
  Bottom 0.203: v25.6,52.93 24.69,53.85 23.06,53.85 IC1.27 | v25.6,47.85 34.54,38.91 34.54,37.19 38.1,33.63 B3.P$5 B3ALT.P$5
GPA7  (via drill 0.41)
  Top 0.203: v20.22,52.43 20.22,52.02 20.73,51.51 20.73,48.16 19.3,46.74 v19.3,35.97 | v19.3,33.22 19.3,28.35 15.24,24.28 B4.P$5
  Bottom 0.203: v20.22,52.43 22.25,54.46 22.96,54.46 IC1.28 | v19.3,33.22 v19.3,35.97
I2C_SCL  (via drill 0.41)
  Top 0.203: JP3.2 54.86,57.4 SERIAL.4 | 33.43,52.02 33.02,52.02 v28.96,47.95 | 33.43,52.02 v36.78,52.02 36.98,52.02 39.22,54.25 43.99,54.25 44.09,54.15 v47.55,54.15 | 21.44,54.66 30.79,54.66 33.43,52.02 | 21.44,54.66 v19.91,54.66 | 21.44,54.66 v17.07,59.03
  Bottom 0.203: v36.78,52.02 37.59,52.83 38.91,52.83 IC2.26 | v28.96,47.95 29.46,47.45 30.28,47.45 IC1.12 | v19.91,54.66 18.8,54.66 R1.1 | v17.07,59.03 15.14,59.03 S3->A2.1 | v47.55,54.15 JP3.2
I2C_SDA  (via drill 0.41)
  Top 0.203: JP3.1 49.48,54.86 | 49.48,54.86 39.22,54.86 37.8,53.44 v37.29,53.44 37.08,53.44 35.15,55.37 v27.23,55.37 23.77,58.83 v21.84,58.83 | SERIAL.3 60.25,66.04 58.93,67.36 57.91,67.36 49.48,58.93 49.48,54.86
  Bottom 0.203: R2.1 16.56,54.66 16.56,56.08 19.3,58.83 19.91,58.83 S3->A3.1 20.02,58.83 v21.84,58.83 | v37.29,53.44 38.91,53.44 IC2.27 | v27.23,55.37 27.23,48.67 29.16,46.74 30.28,46.74 IC1.13
L0
  Bottom 0.203: 14.02,38.1 14.02,39.73 R20.1 | 14.02,38.1 14.02,31.8 B1ALT.P$2 | 14.02,38.1 B1.P$2
L1
  Bottom 0.203: 8.94,38.1 8.94,39.73 R19.1 | 8.94,38.1 8.94,31.8 B1ALT.P$3 | 8.94,38.1 B1.P$3
L2
  Top 0.203: B2.P$2 29.26,38.1 29.26,31.8 B2ALT.P$2
  Bottom 0.203: R18.1 29.26,39.73 29.26,38.1 B2.P$2
L3
  Bottom 0.203: 24.18,38.1 24.18,39.73 R17.1 | 24.18,38.1 24.18,31.8 B2ALT.P$3 | 24.18,38.1 B2.P$3
L4
  Bottom 0.203: 44.5,38.1 44.5,39.73 R16.1 | 44.5,38.1 44.5,31.8 B3ALT.P$2 | 44.5,38.1 B3.P$2
L5
  Top 0.203: B3.P$3 39.42,38.1 39.42,31.8 B3ALT.P$3
  Bottom 0.203: R15.1 39.42,39.73 39.42,38.1 B3.P$3
L6
  Bottom 0.203: R14.1 10.16,17.78 B4.P$2
L7
  Bottom 0.203: R13.1 12.7,17.78 B4.P$3
L8
  Bottom 0.203: R12.1 25.4,17.78 B5.P$2
L9
  Bottom 0.203: R11.1 27.94,17.78 B5.P$3
L10
  Bottom 0.203: R10.1 40.64,17.78 B6.P$2
L11
  Bottom 0.203: R9.1 43.18,17.78 B6.P$3
L12
  Top 0.203: B7.P$2 67.36,38.1 67.36,31.8 B7ALT.P$2
  Bottom 0.203: B7ALT1.P$2 54.66,38.1 54.66,31.8 B7ALT2.P$2 54.66,31.7 54.66,31.09 55.58,30.18 65.73,30.18 B7ALT.P$2 | R8.1 67.36,39.73 67.36,38.1 B7.P$2
L13
  Top 0.203: B7.P$3 B7ALT1.P$3 | B7ALT2.P$3 59.74,31.7 62.18,31.7 B7ALT.P$3
  Bottom 0.203: R7.1 63.5,39.32 62.28,38.1 | 62.28,38.1 62.28,31.8 B7ALT.P$3 | 62.28,38.1 B7.P$3
L14
  Top 0.203: B8.P$2 66.04,15.24 56.69,15.24 55.47,16.46 54.66,16.46 B8ALT1.P$2
  Bottom 0.203: R6.1 67.36,18.19 67.36,16.56 B8.P$2
L15
  Top 0.203: B8ALT1.P$3 59.74,16.46 62.18,16.46 B8.P$3
  Bottom 0.203: R5.1 63.5,17.78 B8.P$3
MOSI
  Bottom 0.203: SERIAL.8 66.04,60.66 68.89,57.81 68.89,56.69 MOSI->D6.1
N$1  (via drill 0.41)
  Top 0.203: v6.3,44.81 6.3,40.74 4.06,38.51 v4.06,33.22 | v4.06,27.84 10.16,21.74 10.16,16.05 14.02,12.19 v41.66,12.19
  Bottom 0.203: v6.3,44.81 13.51,52.02 13.51,65.23 14.53,66.24 23.16,66.24 24.38,65.02 25.2,65.02 JP2.2 | v4.06,27.84 v4.06,33.22 | JP1.2 v41.66,12.19
N$4  (via drill 0.41)
  Top 0.203: v38.3,39.12 38.3,38.81 38.1,38.61 38.1,35.36 36.68,33.93 36.68,30.38 39.32,27.74 39.32,25.5 v38.71,24.89
  Bottom 0.203: v38.3,39.12 38.3,42.67 41.96,46.33 44.81,46.33 IC2.13 | v38.71,24.89 36.47,24.89 35.46,23.88 16.36,23.88 12.7,20.22 R13.2
N$5  (via drill 0.41)
  Top 0.203: v43.28,48.97 42.06,50.19 42.06,51.31 41.55,51.82 40.64,51.82 34.34,45.52 32.51,45.52 28.25,41.25 v28.14,41.25
  Bottom 0.203: v43.28,48.97 43.28,48.06 44.3,47.04 44.81,47.04 IC2.12 | v28.14,41.25 28.14,38.81 27.94,38.61 27.94,26.62 28.65,25.91 28.65,25.3 27.64,24.28 14.53,24.28 10.16,19.91 R14.2
N$7  (via drill 0.41)
  Top 0.203: v47.04,47.14 47.04,42.77 44.5,40.23 v40.44,40.23
  Bottom 0.203: v47.04,47.14 46.63,47.55 44.91,47.55 IC2.11 | v40.44,40.23 40.44,40.44 39.42,41.45 R15.2
N$9  (via drill 0.41)
  Top 0.203: v45.92,48.26 45.92,43.28 v45.21,42.57
  Bottom 0.203: v45.92,48.26 44.91,48.26 IC2.10 | v45.21,42.57 45.21,42.27 44.5,41.55 R16.2
N$10  (via drill 0.41)
  Top 0.203: v43.38,49.89 43.38,50.49 42.47,51.41 42.47,51.51 41.76,52.22 40.44,52.22 34.14,45.92 32.31,45.92 28.65,42.27 v25.2,42.27
  Bottom 0.203: v43.38,49.89 44.3,48.97 44.81,48.97 IC2.9 | v25.2,42.27 24.89,42.27 24.18,41.55 R17.2
N$11  (via drill 0.41)
  Top 0.203: v45.92,49.17 45.72,48.97 45.62,48.97 42.06,45.41 42.06,44.2 40.03,42.16 30.89,42.16 v30.28,41.55
  Bottom 0.203: v45.92,49.17 45.52,49.58 44.91,49.58 IC2.8 | v30.28,41.55 29.26,41.55 R18.2
N$12  (via drill 0.41)
  Top 0.203: v45.92,50.19 45.21,49.48 45.21,49.28 43.79,47.85 v42.06,47.85 | v40.13,47.85 37.49,47.85 34.04,44.4 34.04,43.99 33.43,43.38 v32.21,43.38 | v30.48,45.11 28.35,42.98 23.57,42.98 v23.27,43.28
  Bottom 0.203: v45.92,50.19 44.91,50.19 IC2.7 | v40.13,47.85 v42.06,47.85 | v30.48,45.11 v32.21,43.38 | v23.27,43.28 10.67,43.28 8.94,41.55 R19.2
N$19  (via drill 0.41)
  Top 0.203: v46.74,49.68 46.74,47.95 46.33,47.55 46.33,42.67 44.6,40.95 38.61,40.95 36.58,38.91 36.58,36.17 v35.26,34.85 | v33.33,36.78 32.31,36.78 28.55,40.54 24.99,40.54 v23.16,42.37
  Bottom 0.203: v46.74,49.68 46.74,50.39 46.23,50.9 44.91,50.9 IC2.6 | v33.33,36.78 v35.26,34.85 | v23.16,42.37 14.83,42.37 14.02,41.55 R20.2
N$20  (via drill 0.41)
  Top 0.203: v37.39,38.71 37.39,35.26 v35.26,33.12 | v34.54,29.77 34.54,29.26 v28.45,23.16
  Bottom 0.203: v37.39,38.71 37.39,39.22 37.9,39.73 37.9,42.88 38.91,43.89 38.91,45.62 IC2.15 | v35.26,33.12 35.26,32.92 34.54,32.21 v34.54,29.77 | v28.45,23.16 28.45,22.96 25.4,19.91 R12.2
N$21  (via drill 0.41)
  Top 0.203: v37.9,46.33 37.9,43.99 v36.78,42.88 | v34.75,40.84 34.75,39.32 34.04,38.61 34.04,34.24 27.23,27.43 27.23,21.34 v27.53,21.03
  Bottom 0.203: v37.9,46.33 38.91,46.33 IC2.16 | v34.75,40.84 v36.78,42.88 | v27.53,21.03 27.53,20.32 27.94,19.91 R11.2
N$22  (via drill 0.41)
  Top 0.203: v40.13,46.94 40.13,43.28 v40.03,43.18 | v40.64,26.42 40.64,22.96 41.15,22.45 41.15,21.13 v41.05,21.03
  Bottom 0.203: v40.13,46.94 39.01,46.94 IC2.17 | v40.03,43.18 40.03,42.37 41.15,41.25 41.15,39.12 40.64,38.61 40.64,35.46 40.95,35.15 40.95,32.51 40.64,32.21 v40.64,26.42 | v41.05,21.03 41.05,20.32 40.64,19.91 R10.2
N$23  (via drill 0.41)
  Top 0.203: v35.87,39.83 34.54,38.51 34.54,30.79 36.88,28.45 36.88,25.7 v40.44,22.15
  Bottom 0.203: v35.87,39.83 37.49,41.45 37.49,43.18 37.19,43.48 37.19,46.63 38.1,47.55 38.91,47.55 IC2.18 | v40.44,22.15 40.95,22.15 43.18,19.91 R9.2
N$24  (via drill 0.41)
  Top 0.203: v32,39.42 v34.04,41.45 | v43.38,26.01 46.23,26.01 v46.94,25.3 | v66.95,30.28 67.56,30.28 69.8,32.51 69.8,39.01 v68.38,40.44
  Bottom 0.203: v34.04,41.45 34.04,44.4 37.9,48.26 38.91,48.26 IC2.19 | v32,39.42 32,31.29 37.59,25.7 43.08,25.7 v43.38,26.01 | v46.94,25.3 47.85,24.38 61.06,24.38 v66.95,30.28 | v68.38,40.44 67.36,41.45 R8.2
N$25  (via drill 0.41)
  Top 0.203: v42.37,48.87 42.98,48.26 43.59,48.26 44.81,49.48 44.81,50.09 45.62,50.9 46.53,50.9 48.46,48.97 v48.46,45.72 | v52.32,34.54 53.34,34.54 55.88,37.08 55.88,38.61 57.61,40.34 v62.38,40.34
  Bottom 0.203: v42.37,48.87 39.01,48.87 IC2.20 | v48.46,45.72 49.48,44.7 49.48,34.04 50.29,33.22 51.31,33.22 52.32,34.24 v52.32,34.54 | v62.38,40.34 63.5,41.45 R7.2
N$26  (via drill 0.41)
  Top 0.203: v35.26,49.58 33.93,49.58 v28.04,43.69 | v37.39,32 38.91,30.48 39.83,30.48 40.64,31.29 40.64,32.21 41.45,33.02 v42.77,33.02 | v45.21,29.26 47.95,29.26 50.29,26.92 58.32,26.92 v61.57,23.67
  Bottom 0.203: v35.26,49.58 38.91,49.58 IC2.21 | v28.04,43.69 29.36,42.37 30.48,42.37 34.14,38.71 34.14,36.98 36.88,34.24 36.88,32.51 v37.39,32 | v42.77,33.02 42.77,32.61 43.18,32.21 43.18,31.29 v45.21,29.26 | v61.57,23.67 61.57,23.37 65.02,19.91 67.26,19.91 R6.2
N$27  (via drill 0.41)
  Top 0.203: v43.69,51.21 45.31,51.21 45.41,51.31 47.45,51.31 49.28,49.48 49.28,36.07 v48.77,35.56
  Bottom 0.203: v43.69,51.21 42.67,50.19 39.01,50.19 IC2.22 | v48.77,35.56 48.77,33.73 46.94,31.9 46.94,26.31 46.23,25.6 46.23,23.47 47.85,21.84 52.43,21.84 54.46,23.88 59.84,23.88 63.5,20.22 R5.2
N$33  (via drill 0.41)
  Top 0.203: v10.16,40.95 13.72,44.5 13.72,65.43 14.53,66.24 18.09,66.24 19.3,65.02 20.12,65.02 JP2.4 | v12.29,25.4 12.29,22.25 19.3,15.24 v25.2,15.24
  Bottom 0.203: v10.16,40.95 10.16,27.53 v12.29,25.4 | v25.2,15.24 32.72,15.24 33.02,15.54 37.29,15.54 JP1.4
N$34  (via drill 0.41)
  Top 0.203: JP2.5 17.58,60.55 16.36,59.33 16.36,57.71 17.98,56.08 17.98,46.13 16.76,44.91 v16.76,35.97 | v24.08,23.06 v22.15,24.99
  Bottom 0.203: v16.76,35.97 16.76,30.38 v22.15,24.99 | v24.08,23.06 24.08,18.69 21.95,16.56 21.95,15.95 24.99,12.9 34.75,12.9 JP1.5
N$45  (via drill 0.41)
  Top 0.203: JP2.6 15.04,44.81 v12.7,42.47 | v19.1,24.99 19.1,19.81 v22.66,16.26
  Bottom 0.203: v12.7,42.47 12.7,31.29 15.44,28.55 16.05,28.55 19.1,25.5 v19.1,24.99 | v22.66,16.26 24.69,14.22 JP1.6
RESET
  Top 0.203: S2.3 S1.3 11.48,59.74 11.48,56.08 12.5,55.07 12.5,49.07 S4.B2 12.39,49.07 11.18,47.85 6.91,47.85 2.54,43.48 U1.RES
SCLK
  Bottom 0.203: SERIAL.7 68.89,63.2 68.89,59.23 SCLK->D5.2
SLIDER_IN  (via drill 0.41)
  Top 0.203: U1.A0 2.54,24.89 4.06,23.37 4.06,19 13.92,9.14 44.09,9.14 49.28,14.33 v49.28,26.92 | v62.28,57.91 67.36,62.99 67.36,66.55 66.55,67.36 64.82,67.36 SERIAL.5
  Bottom 0.203: v49.28,26.92 49.28,30.99 51.1,32.82 51.61,32.82 53.03,34.24 53.03,34.85 52.12,35.76 52.12,39.62 59.03,46.53 59.03,49.38 62.28,52.63 v62.28,57.91

### Text on the board
_tsilk: RESET | PROGRAMMING HEADER | 1
_bsilk: SLIDER | SCLK | 5V | GND | SDA | PROGRAMMING HEADER | GND/BLACK | 1 | 5V | RESET BUTTON | SCL | DISP | MOSI | A5-SCL | A4-SDA | SCL | SDA | I2C PULL-UP | RESET | GITHUB: SKAARHOJ-Open-Engineering | PCB-BI8-SE-C30 | v07-13 | SKAARHOJ 2013